# Altium schematic sheet led_RGB.SchDoc
size A4
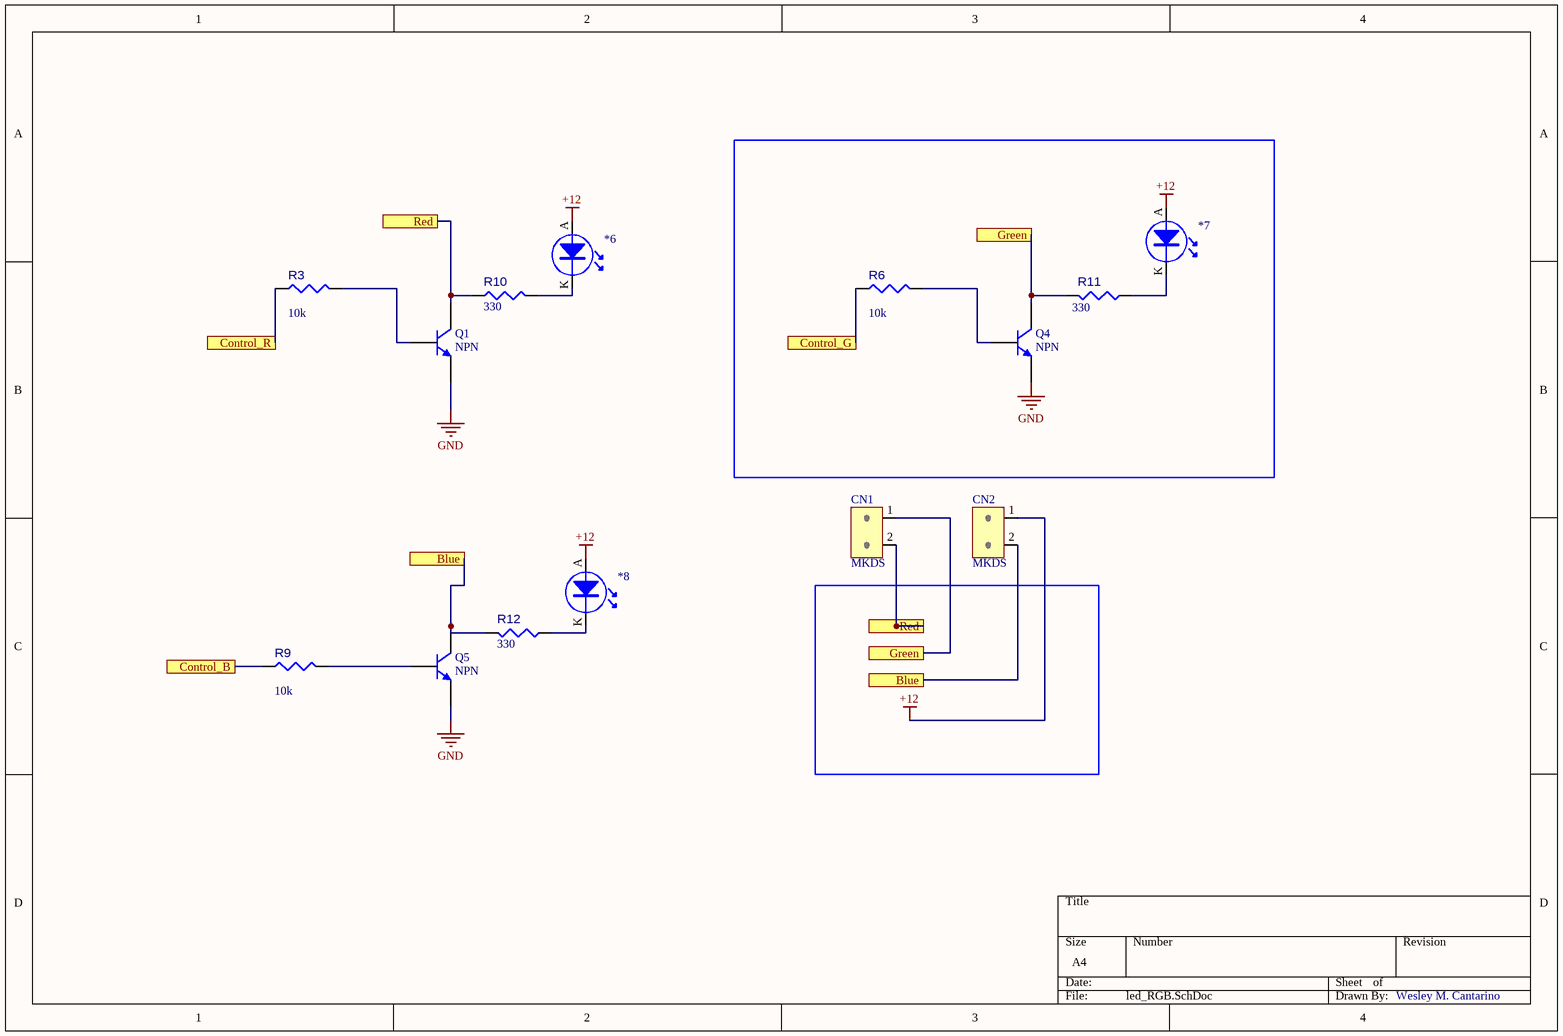
[diagram p0: led_RGB.SchDoc]

## Parts
*6  LED_AXIAL_5MM  [HEADER_1X2]  (value not drawn)
*7  LED_AXIAL_5MM  [HEADER_1X2]  (value not drawn)
*8  LED_AXIAL_5MM  [HEADER_1X2]  (value not drawn)
CN1  MKDS  [MKDSN02]
CN2  MKDS  [MKDSN02]
Q1  NPN  [HEADER_1X3]
Q4  NPN  [HEADER_1X3]
Q5  NPN  [HEADER_1X3]
R3  10k  [RES_PTH_7.62MM]
R6  10k  [RES_PTH_7.62MM]
R9  10k  [RES_PTH_7.62MM]
R10  330  [RES_PTH_7.62MM]
R11  330  [RES_PTH_7.62MM]
R12  330  [RES_PTH_7.62MM]

## Ports
Blue, Control_B, Control_G, Control_R, Green, Red

## Nets
+12: *6.A *7.A *8.A CN2.1
GND: Q1.3(E) Q4.3(E) Q5.3(E)
Blue: CN2.2 Q5.1(C) R12.2 ; port Blue
Control_B: R9.1 ; port Control_B
Control_G: R6.1 ; port Control_G
Control_R: R3.1 ; port Control_R
Green: CN1.1 Q4.1(C) R11.2 ; port Green
Red: CN1.2 Q1.1(C) R10.1 ; port Red
Net*6_K: *6.K R10.2
Net*7_K: *7.K R11.1
Net*8_K: *8.K R12.1
NetQ1_2: Q1.2(B) R3.2
NetQ4_2: Q4.2(B) R6.2
NetQ5_2: Q5.2(B) R9.2

## Notes on the sheet
- Wesley M. Cantarino

## Library data of the parts
*6-*8 = LED_AXIAL_5MM: pin to pad: A>1 K>2; Value: ?
CN1 CN2 = CN_2: Value: MKDS; Digikey: 277-5893-ND; Footprint: MKDSN02 2.54pitch
Q1 Q4 Q5 = NPN: NPN Bipolar Transistor; pin to pad: 1>2 2>1; Published: 8-Jun-2000; LatestRevisionDate: 17-Jul-2002; LatestRevisionNote: Re-released for DXP Platform.; PackageReference: TO-226-AA; Publisher: Altium Limited; PackageDescription: TO, Flat Index; 3 In-Line, Axial Leads; Body Dia. 4.8mm; Leads 0.55 x 0.51 mm (max); Code_JEDEC: TO-226-AA
R3 R6 R9-R12 = RES_PTH_7.62MM: Pin Through Hole Resistor 7.62mm
  R3 R6 R9: Value: 10k
  R10-R12: Value: 330